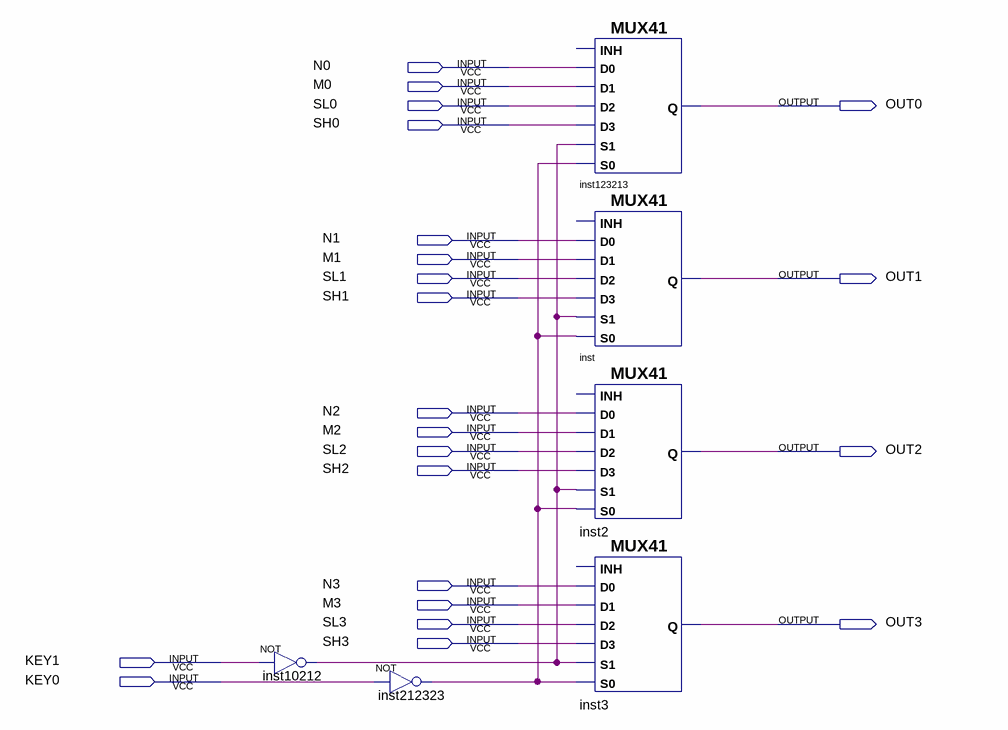
[diagram p0: schematic sheet]
// Quartus schematic FourMUX41.bdf as structural Verilog: 6 symbols, 22 pins
module FourMUX41 (
  input  N0,
  input  M0,
  input  SL0,
  input  SH0,
  input  N1,
  input  M1,
  input  SL1,
  input  SH1,
  input  N2,
  input  M2,
  input  SL2,
  input  SH2,
  input  N3,
  input  M3,
  input  SL3,
  input  SH3,
  input  KEY1,
  input  KEY0,
  output OUT0,
  output OUT1,
  output OUT2,
  output OUT3
);

  wire inst10212_out, inst212323_out;

  not inst10212 (inst10212_out, KEY1);
  not inst212323 (inst212323_out, KEY0);
  MUX41 inst123213 (
    .S0(inst212323_out), .D2(SL0), .S1(inst10212_out), .D3(SH0), .D0(N0), .D1(M0), .Q(OUT0));  // open: INH
  MUX41 inst (.S0(inst212323_out), .D2(SL1), .S1(inst10212_out), .D3(SH1), .D0(N1), .D1(M1), .Q(OUT1));  // open: INH
  MUX41 inst2 (.S0(inst212323_out), .D2(SL2), .S1(inst10212_out), .D3(SH2), .D0(N2), .D1(M2), .Q(OUT2));  // open: INH
  MUX41 inst3 (.S0(inst212323_out), .D2(SL3), .S1(inst10212_out), .D3(SH3), .D0(N3), .D1(M3), .Q(OUT3));  // open: INH
endmodule
